# Altium schematic sheet OSSI-1 EPS_2.SchDoc: TITLE:
size 410 x 286 mm; Date: Date:; >LAST_DATE_TIME: 01/11/2015 13:27:52; Sheet:: Sheet:; >SHEET: 3; REV:: REV:; Document Number:: Document Number:; >DRAWING_NAME: OSSI-1 EPS.sch
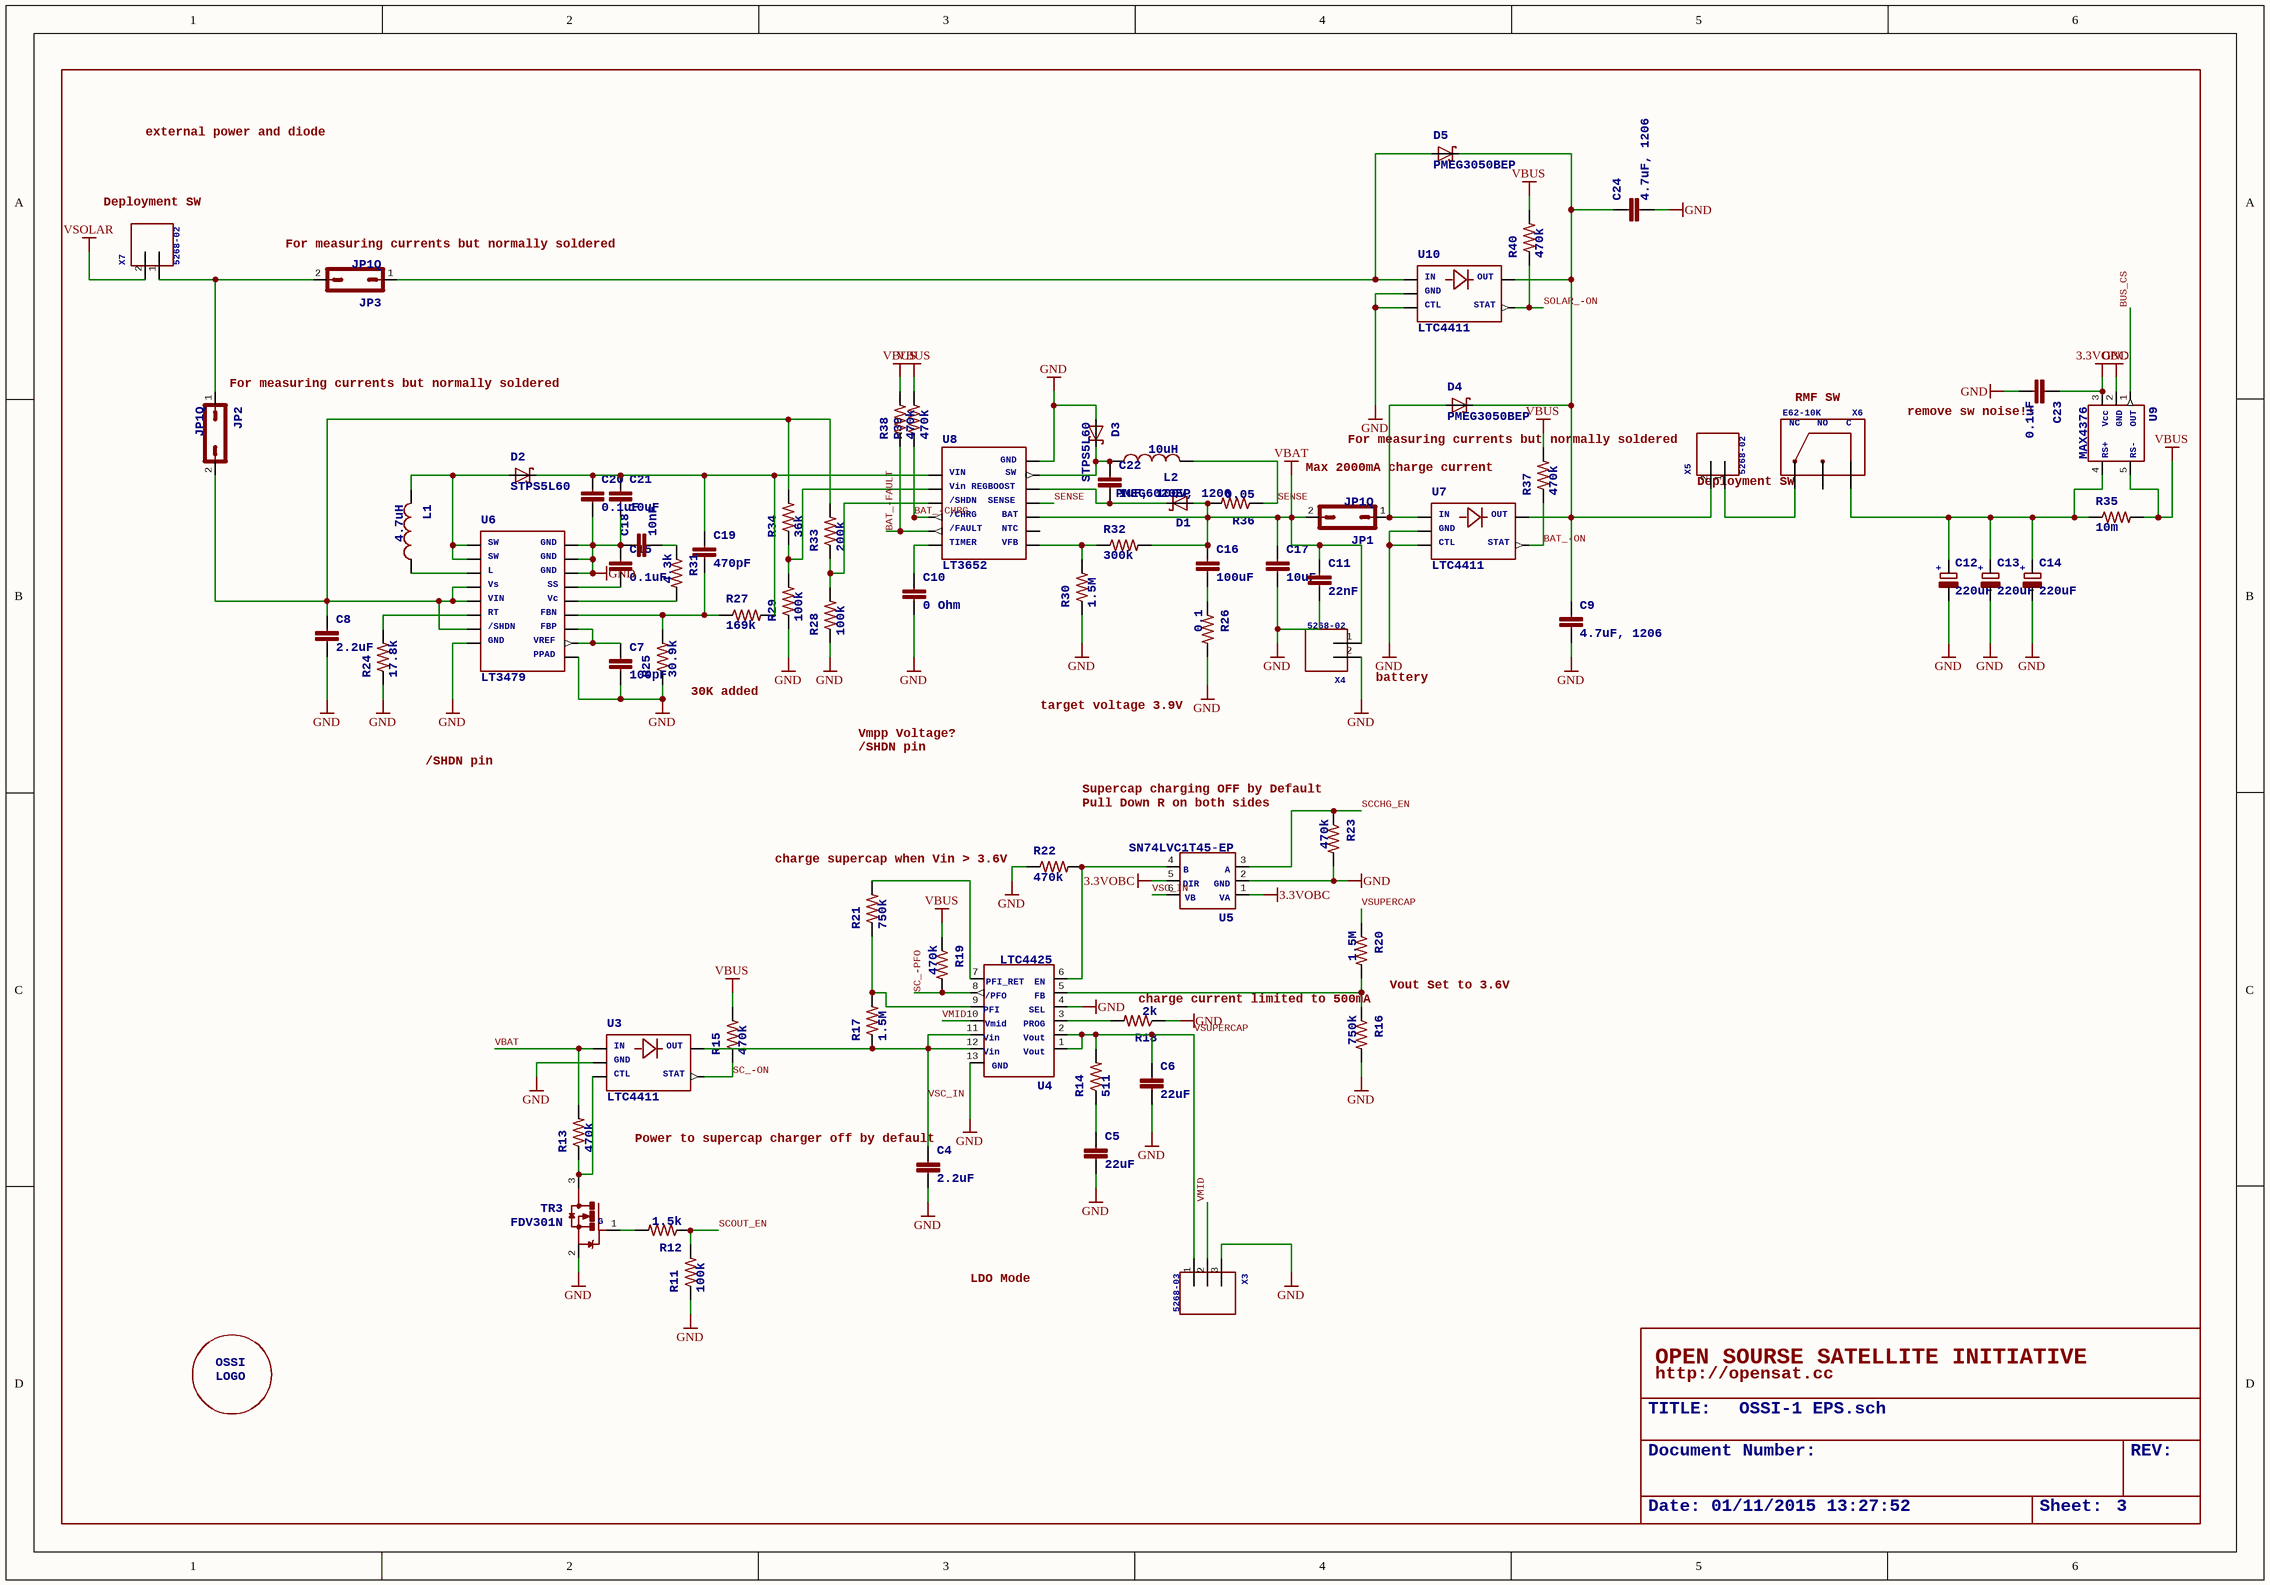
[diagram p0: OSSI-1 EPS_2.SchDoc]

## Parts
C4  >NAME: C4  [C1206-GCM31]  (hidden comment: 2.2uF)
C5  >NAME: C5  [C1210-GCM32]  (hidden comment: 22uF)
C6  >NAME: C6  [C1210-GCM32]  (hidden comment: 22uF)
C7  >NAME: C7  [C0603(1608)]  (hidden comment: 100pF)
C8  >NAME: C8  [C1206-GCM31]  (hidden comment: 2.2uF)
C9  >NAME: C9  [C1206-GCM31]  (hidden comment: 4.7uF, 1206)
C10  >NAME: C10  [C0603(1608)]  (hidden comment: 0 Ohm)
C11  >NAME: C11  [C0603(1608)]  (hidden comment: 22nF)
C12  >NAME: C12  [C2917(7343)-Y]  (hidden comment: 220uF)
C13  >NAME: C13  [C2917(7343)-Y]  (hidden comment: 220uF)
C14  >NAME: C14  [C2917(7343)-Y]  (hidden comment: 220uF)
C15  >NAME: C15  [C0603(1608)]  (hidden comment: 0.1uF)
C16  >NAME: C16  [C1210-TMK325]  (hidden comment: 100uF)
C17  >NAME: C17  [C1210-GCM32]  (hidden comment: 10uF)
C18  >NAME: C18  [C0603(1608)]  (hidden comment: 10nF)
C19  >NAME: C19  [C0603(1608)]  (hidden comment: 470pF)
C20  >NAME: C20  [C0603(1608)]  (hidden comment: 0.1uF)
C21  >NAME: C21  [C1210-GCM32]  (hidden comment: 10uF)
C22  >NAME: C22  [C0805(2012)]  (hidden comment: 1uF, 100V, 1206)
C23  >NAME: C23  [C0603(1608)]  (hidden comment: 0.1uF)
C24  >NAME: C24  [C1206-GCM31]  (hidden comment: 4.7uF, 1206)
D1  >NAME: D1  [PMEG6020EP]  (hidden comment: PMEG6020EP)
D2  >NAME: D2  [STPS5L60]  (hidden comment: STPS5L60)
D3  >NAME: D3  [STPS5L60]  (hidden comment: STPS5L60)
D4  >NAME: D4  [PMEG6020EP]  (hidden comment: PMEG3050BEP)
D5  >NAME: D5  [PMEG6020EP]  (hidden comment: PMEG3050BEP)
JP1  JP1Q  [JP1]
JP2  >NAME: JP2  [JP1]  (hidden comment: JP1Q)
JP3  >NAME: JP3  [JP1]  (hidden comment: JP1Q)
L1  >NAME: L1  [RLF7030]  (hidden comment: 4.7uH)
L2  >NAME: L2  [RLF12545]  (hidden comment: 10uH)
R11  >NAME: R11  [R0603(1608)]  (hidden comment: 100k)
R12  >NAME: R12  [R0603(1608)]  (hidden comment: 1.5k)
R13  >NAME: R13  [R0603(1608)]  (hidden comment: 470k)
R14  >NAME: R14  [WSL1206]  (hidden comment: 511)
R15  >NAME: R15  [R0603(1608)]  (hidden comment: 470k)
R16  >NAME: R16  [R0603(1608)]  (hidden comment: 750k)
R17  >NAME: R17  [R0603(1608)]  (hidden comment: 1.5M)
R18  >NAME: R18  [R0603(1608)]  (hidden comment: 2k)
R19  >NAME: R19  [R0603(1608)]  (hidden comment: 470k)
R20  >NAME: R20  [R0603(1608)]  (hidden comment: 1.5M)
R21  >NAME: R21  [R0603(1608)]  (hidden comment: 750k)
R22  >NAME: R22  [R0603(1608)]  (hidden comment: 470k)
R23  >NAME: R23  [R0603(1608)]  (hidden comment: 470k)
R24  >NAME: R24  [R0603(1608)]  (hidden comment: 17.8k)
R25  >NAME: R25  [R0603(1608)]  (hidden comment: 30.9k)
R26  >NAME: R26  [WSL1206]  (hidden comment: 0.1)
R27  >NAME: R27  [R0603(1608)]  (hidden comment: 169k)
R28  >NAME: R28  [R0603(1608)]  (hidden comment: 100k)
R29  >NAME: R29  [R0603(1608)]  (hidden comment: 100k)
R30  >NAME: R30  [R0603(1608)]  (hidden comment: 1.5M)
R31  >NAME: R31  [R0603(1608)]  (hidden comment: 4.3k)
R32  >NAME: R32  [R0603(1608)]  (hidden comment: 300k)
R33  >NAME: R33  [R0603(1608)]  (hidden comment: 200k)
R34  >NAME: R34  [R0603(1608)]  (hidden comment: 36k)
R35  >NAME: R35  [WSL1206]  (hidden comment: 10m)
R36  >NAME: R36  [WSL1206]  (hidden comment: 0.05)
R37  >NAME: R37  [R0603(1608)]  (hidden comment: 470k)
R38  >NAME: R38  [R0603(1608)]  (hidden comment: 470k)
R39  >NAME: R39  [R0603(1608)]  (hidden comment: 470k)
R40  >NAME: R40  [R0603(1608)]  (hidden comment: 470k)
TR3  >NAME: TR3  [SOT23]  (hidden comment: FDV301N)
U3  >NAME: U3  [TSOT23-5]  (hidden comment: LTC4411)
U4  >NAME: U4  [MSE]  (hidden comment: LTC4425)
U5  >NAME: U5  [SOT-6DCK]  (hidden comment: SN74LVC1T45-EP)
U6  >NAME: U6  [TSSOP16-FE]  (hidden comment: LT3479)
U7  >NAME: U7  [TSOT23-5]  (hidden comment: LTC4411)
U8  >NAME: U8  [MSE]  (hidden comment: LT3652)
U9  >NAME: U9  [SOT23-5DBV]  (hidden comment: MAX4376)
U10  >NAME: U10  [TSOT23-5]  (hidden comment: LTC4411)
U$1  OSSILOGORECT  [OSSILOGORECT1005]  (value not drawn)
X3  >NAME: X3  [5268-03]  (hidden comment: 5268-03)
X4  >NAME: X4  [5628-02]  (hidden comment: 5268-02)
X5  >NAME: X5  [5628-02]  (hidden comment: 5268-02)
X6  >NAME: X6  [E62-10K]  (hidden comment: E62-10K)
X7  >NAME: X7  [5628-02]  (hidden comment: 5268-02)

## Nets
3.3VOBC: C23.1 U5.1(P$1) U5.5(P$5) U9.3(P$3)
GND: C4.P$2 C5.P$2 C6.P$2 C7.2 C8.P$2 C9.P$2 C10.2 C11.2 C12.2(-) C13.2(-) C14.2(-) C15.1 C17.P$2 C18.1 C20.2 C21.P$2 C23.2 C24.P$2 D3.A R11.1 R16.2 R18.1 R22.1 R23.2 R24.1 R25.1 R26.P$2 R28.1 R29.1 R30.1 TR3.2(S) U3.P$2 U4.4(P$4) U4.13(P$13) U5.2(P$2) U6.8(P$8) U6.14(P$14) U6.15(P$15) U6.16(P$16) U6.PPAD(P$17) U7.P$2 U7.P$3 U8.13(P$13) U9.2(P$2) U10.P$2 U10.P$3 X3.3 X4.2
VBAT: C11.1 C16.P$1 C17.P$1 D1.A JP1.2 R13.2 R32.2 R36.P$2 U3.P$1 U8.9(P$9) X4.1
VBUS: R15.2 R19.1 R35.P$2 R37.2 R38.2 R39.2 R40.2 U9.5(P$5)
VSOLAR: X7.2
BAT_-CHRG: R39.1 U8.4(P$4)
BAT_-FAULT: R38.1 U8.5(P$5)
BAT_-ON: R37.1 U7.P$4
BUS_CS: U9.1(P$1)
SC_-ON: R15.1 U3.P$4
SC_-PFO: R19.2 U4.8(P$8)
SCCHG_EN: R23.1 U5.3(P$3)
SCOUT_EN: R11.2 R12.1
SENSE: L2.P$2 R36.P$1 U8.10(P$10)
SOLAR_-ON: R40.1 U10.P$4
VMID: U4.10(P$10) X3.2
VSC_IN: C4.P$1 R17.1 U3.P$5 U4.11(P$11) U4.12(P$12) U5.6(P$6)
VSUPERCAP: C6.P$1 R14.P$2 R20.1 U4.1(P$1) U4.2(P$2) X3.1
NetC5_P$1: C5.P$1 R14.P$1
NetC7_1: C7.1 U6.9(P$9) U6.10(P$10)
NetC8_P$1: C8.P$1 JP2.2 R33.2 R34.2 U6.4(P$4) U6.5(P$5) U6.7(P$7)
NetC9_P$1: C9.P$1 C24.P$1 D4.C D5.C U7.P$5 U10.P$5 X5.2
NetC10_1: C10.1 U8.6(P$6)
NetC12_1: C12.1(+) C13.1(+) C14.1(+) R35.P$1 U9.4(P$4) X6.C
NetC15_2: C15.2 U6.13(P$13)
NetC16_P$2: C16.P$2 R26.P$1
NetC18_2: C18.2 R31.1
NetC19_1: C19.1 C20.1 C21.P$1 D2.C R27.2 U8.1(P$1)
NetC19_2: C19.2 R25.2 R27.1 U6.11(P$11)
NetC22_1: C22.1 D3.C L2.P$1 U8.12(P$12)
NetC22_2: C22.2 D1.C U8.11(P$11)
NetD2_A: D2.A L1.P$2 U6.1(P$1) U6.2(P$2)
NetD4_A: D4.A JP1.1 U7.P$1
NetD5_A: D5.A JP3.1 U10.P$1
NetJP2_1: JP2.1 JP3.2 X7.1
NetL1_P$1: L1.P$1 U6.3(P$3)
NetR12_2: R12.2 TR3.1(G)
NetR13_1: R13.1 TR3.3(D) U3.P$3
NetR16_1: R16.1 R20.2 U4.5(P$5)
NetR17_2: R17.2 R21.1 U4.9(P$9)
NetR18_2: R18.2 U4.3(P$3)
NetR21_2: R21.2 U4.7(P$7)
NetR22_2: R22.2 U4.6(P$6) U5.4(P$4)
NetR24_2: R24.2 U6.6(P$6)
NetR28_2: R28.2 R33.1 U8.3(P$3)
NetR29_2: R29.2 R34.1 U8.2(P$2)
NetR30_2: R30.2 R32.1 U8.7(P$7)
NetR31_2: R31.2 U6.12(P$12)
NetX5_1: X5.1 X6.NC

Not connected (* = marked no-connect by the designer): U8 8(P$8); X6 NO

## Notes on the sheet
- external power and diode
- (near X7) Deployment SW
- (near JP3) For measuring currents but normally soldered
- (near JP2) For measuring currents but normally soldered
- RMF SW
- (near C23) remove sw noise!!
- Max 2000mA charge current
- (near R37) For measuring currents but normally soldered
- Deployment SW
- (near R25) 30K added
- (near X4) battery
- /SHDN pin
- Vmpp Voltage?
- target voltage 3.9V
- Supercap charging OFF by Default
- Pull Down R on both sides
- (near R21) charge supercap when Vin > 3.6V
- (near R18) charge current limited to 500mA
- Vout Set to 3.6V
- Power to supercap charger off by default
- LDO Mode
- OPEN SOURSE SATELLITE INITIATIVE
- http://opensat.cc

## Library data of the parts
C4 C8 C9 C24 = C1206(3216)-GCM31
  C4 C8: >VALUE: 2.2uF
  C9 C24: >VALUE: 4.7uF, 1206
C5 C6 C17 C21 = C1210(3225)-GCM32
  C5 C6: >VALUE: 22uF
  C17 C21: >VALUE: 10uF
C7 C10 C11 C15 C18-C20 C23 = C0603(1608)
  C7: >VALUE: 100pF
  C10: >VALUE: 0 Ohm
  C11: >VALUE: 22nF
  C15 C20 C23: >VALUE: 0.1uF
  C18: >VALUE: 10nF
  C19: >VALUE: 470pF
C12-C14 = C-TANTAL-Y: <b>TAJY227K010RNJ</b> / <ul> / <li>Taltal Capacitor</li> / <li> manufacture: AVX </li> / <li>2917(7343)</li> / </ul>; +: +; >VALUE: 220uF
C16 = C1210(3225)-TMK325: >VALUE: 100uF
C22 = C0805(2012): >VALUE: 1uF, 100V, 1206
D2 D3 = STPS5L60: <b>STPS5L60</b> / If: 5A / Vrrm: 60V / Vf: 0.47V @ 5A; >VALUE: STPS5L60
D4 D5 = PMEG6020EP: >VALUE: PMEG3050BEP
JP1-JP3 = JP1Q: <b>JUMPER</b>; >VALUE: JP1Q
  JP1: >NAME: JP1
L1 = LRLF7030: >VALUE: 4.7uH
L2 = LRLF12545: >VALUE: 10uH
R11-R13 R15-R25 R27-R34 R37-R40 = R0603(1608)
  R11 R28 R29: >VALUE: 100k
  R12: >VALUE: 1.5k
  R13 R15 R19 R22 R23 R37-R40: >VALUE: 470k
  R16 R21: >VALUE: 750k
  R17 R20 R30: >VALUE: 1.5M
  R18: >VALUE: 2k
  R24: >VALUE: 17.8k
  R25: >VALUE: 30.9k
  R27: >VALUE: 169k
  R31: >VALUE: 4.3k
  R32: >VALUE: 300k
  R33: >VALUE: 200k
  R34: >VALUE: 36k
R14 R26 R35 R36 = RWSL1206
  R14: >VALUE: 511
  R26: >VALUE: 0.1
  R35: >VALUE: 10m
  R36: >VALUE: 0.05
TR3 = FDV301N: FDV301N Digital N channel - FET / Rdson = 5 Ohm / Vgs = 0.7~1.06V / Ids = 220mA; G: G; >VALUE: FDV301N
U3 U7 U10 = LTC4411: <b>Linear Techonology LTC4411 ideal diode</b> / <ul> / <li>Small Regulated Forward Voltage (28mV)</li> / <li>2.6A Maximum Forward Current</li> / <li>2.6V to 5.5V Operating Range</li> / <li>MOSFET based</li> / </ul>; IN: IN; GND: GND; CTL: CTL; OUT: OUT; STAT: STAT; >VALUE: LTC4411
U4 = LTC4425: LTC4425 Linear SuperCap Charger With Current-Limited Ideal Diode and V/I Monitor; >VALUE: LTC4425; Vout: Vout; PROG: PROG; SEL: SEL; FB: FB; EN: EN; PFI_RET: PFI_RET; /PFO: /PFO; Vmid: Vmid; Vin: Vin; PFI: PFI; GND: GND
U5 = SN74LVC1T45-EP: SN74LVC1T45-EP<BR/> / SINGLE-BIT DUAL-SUPPLY BUS TRANSCEIVER / WITH CONFIGURABLE VOLTAGE TRANSLATION AND 3-STATE OUTPUTS; >VALUE: SN74LVC1T45-EP; VA: VA; GND: GND; A: A; B: B; DIR: DIR; VB: VB
U6 = LT3479: <b>LT3479 inverting switching convertor</b> / <ul> / <li>Input Voltage Range: 2.5V to 24V</li> / <li>3A, 42V Internal Switch</li> / <li> Efﬁciency Power Conversion: Up to 89%</li> / <li> Soft-Start</li> / <li>Frequency Set by External Resistor: 200kHz to 3.5MHz</li> / <li>Protection Against Input Short Circuits and Hot Plugging</li> / </ul>; SW: SW; L: L; Vs: Vs; VIN: VIN; RT: RT; /SHDN: /SHDN; GND: GND; SS: SS; Vc: Vc; FBN: FBN; FBP: FBP; VREF: VREF; >VALUE: LT3479; PPAD: PPAD
U8 = LT3652: <b>LT3652 Battery Charger</b> / <ul> / <li>Power Tracking 2A Battery Charger for Solar Power</li> / <li>e Input Voltage Range: 4.95V to 32V (40V Abs Max)</li> / <li>Programmable Charge Rate Up to 2A</li> / <li>Programmable Float Voltage Up to 14.4V</li> / <li>1MHz Fixed Frequency</li> / </ul>; VIN: VIN; Vin REG: Vin REG; /SHDN: /SHDN; /CHRG: /CHRG; /FAULT: /FAULT; TIMER: TIMER; VFB: VFB; NTC: NTC; BAT: BAT; SENSE: SENSE; BOOST: BOOST; SW: SW; >VALUE: LT3652; GND: GND
X6 = E62-10K: Cherry E620-10K spdt sw for Remove Before Flight pin; >VALUE: E62-10K; C: C; NO: NO; NC: NC
D1 = PMEG6020EP: >VALUE: PMEG6020EP
U9 = MAX4376: >VALUE: MAX4376; OUT: OUT; GND: GND; Vcc: Vcc; RS+: RS+; RS-: RS-
U$1 = OSSILOGORECT: OSSI: OSSI; LOGO: LOGO
X3 = 5268-03: >VALUE: 5268-03
X4 X5 X7 = 5268-02: >VALUE: 5268-02